# Altium project CAN_to_USB_TIVA.PrjPCB
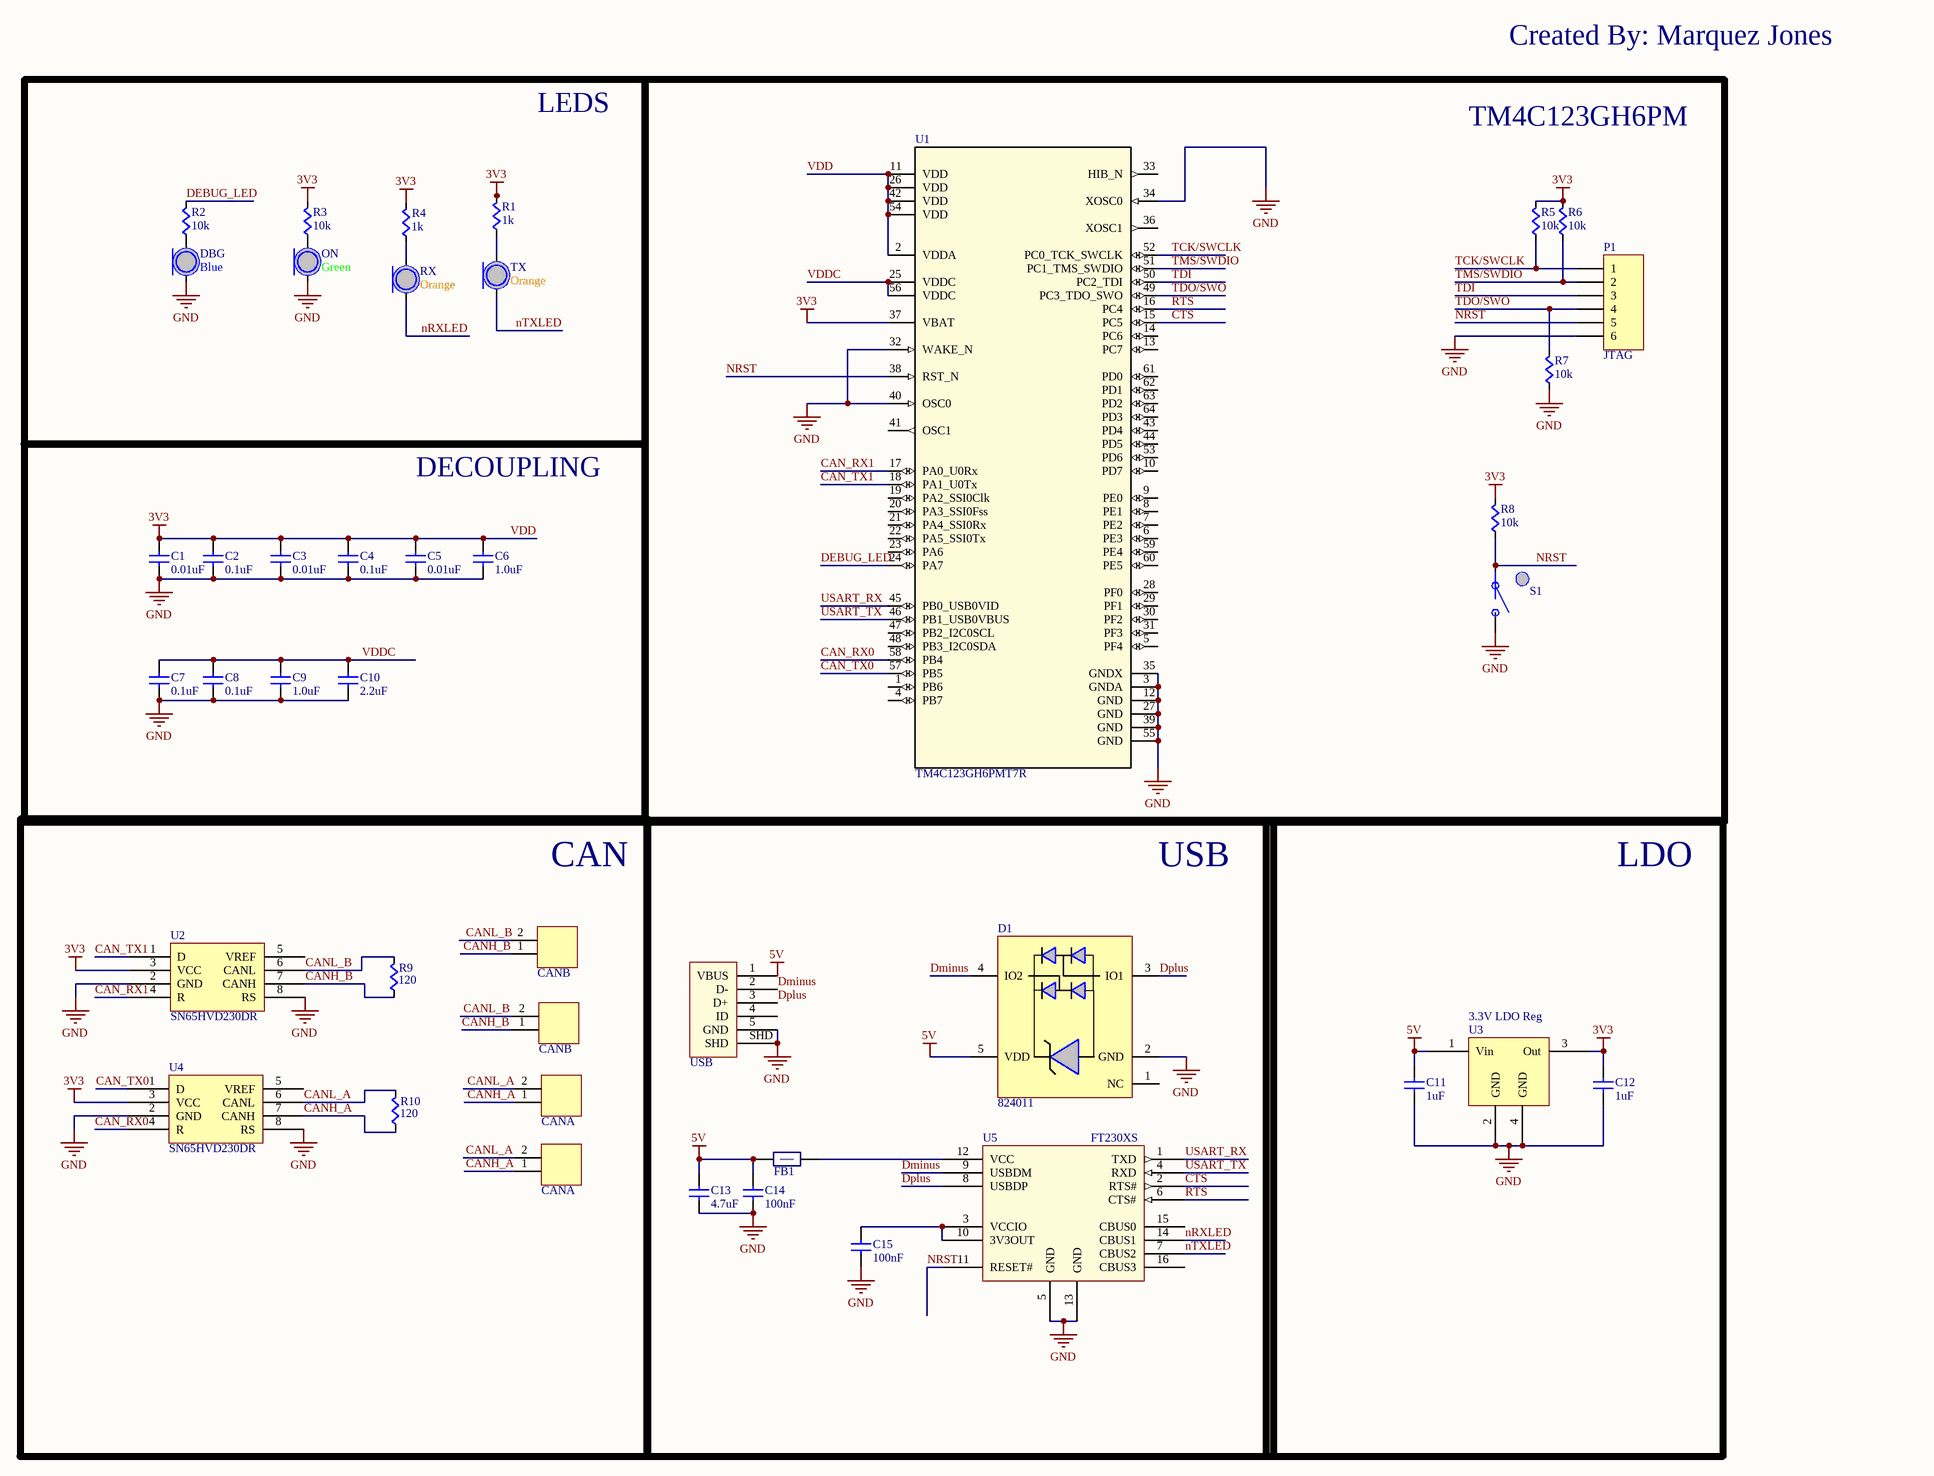
[diagram p0: CAN_TO_USB_TIVA.SchDoc]
1 sheet, 43 parts. Net scope: global (net labels, ports and power ports of the same name join across sheets).
Board file: USB_to_CAN.PcbDoc

## Sheet CAN_TO_USB_TIVA.SchDoc
size C

### Parts
(Parts that share a designator on the sheet are numbered #1, #2 ... from top to bottom, then left to right.)
C1  value 0.01uF  [CAPC0603]  (hidden comment: Cap)
C2  value 0.1uF  [CAPC0603]  (hidden comment: Cap)
C3  value 0.01uF  [CAPC0603]  (hidden comment: Cap)
C4  value 0.1uF  [CAPC0603]  (hidden comment: Cap)
C5  value 0.01uF  [CAPC0603]  (hidden comment: Cap)
C6  value 1.0uF  [CAPC0603]  (hidden comment: Cap)
C7  value 0.1uF  [CAPC0603]  (hidden comment: Cap)
C8  value 0.1uF  [CAPC0603]  (hidden comment: Cap)
C9  value 1.0uF  [CAPC0603]  (hidden comment: Cap)
C10  value 2.2uF  [CAPC0603]  (hidden comment: Cap)
C11  value 1uF  [CAPC0603]  (hidden comment: Cap)
C12  value 1uF  [CAPC0603]  (hidden comment: Cap)
C13  value 4.7uF  [CAPC0603]  (hidden comment: Cap)
C14  value 100nF  [CAPC0603]  (hidden comment: Cap)
C15  value 100nF  [CAPC0603]  (hidden comment: Cap)
CANA#1  2-pin Horz Sherlock  [MOLEX-HDR-1X2-SHERLOCK-HORZ]  (value not drawn)
CANA#2  2-pin Horz Sherlock  [MOLEX-HDR-1X2-SHERLOCK-HORZ]  (value not drawn)
CANB#1  2-pin Horz Sherlock  [MOLEX-HDR-1X2-SHERLOCK-HORZ]  (value not drawn)
CANB#2  2-pin Horz Sherlock  [MOLEX-HDR-1X2-SHERLOCK-HORZ]  (value not drawn)
D1  824011  [SOT95P280X116-5N]
DBG  Color: Blue  [LED0603]  (hidden comment: LED)
FB1  FBead  [RES0603]  (value not drawn)
ON  Color: Green  [LED0603]  (hidden comment: LED)
P1  JTAG  [HDR1X6]
R1  value 1k  [RES0603]  (hidden comment: Res)
R2  value 10k  [RES0603]  (hidden comment: Res)
R3  value 10k  [RES0603]  (hidden comment: Res)
R4  value 1k  [RES0603]  (hidden comment: Res)
R5  value 10k  [RES0603]  (hidden comment: Res)
R6  value 10k  [RES0603]  (hidden comment: Res)
R7  value 10k  [RES0603]  (hidden comment: Res)
R8  value 10k  [RES0603]  (hidden comment: Res)
R9  value 120  [RES0603]  (hidden comment: Res)
R10  value 120  [RES0603]  (hidden comment: Res)
RX  Color: Orange  [LED0603]  (hidden comment: LED)
S1  Button  [PTS645xxxxSMTR92]  (value not drawn)
TX  Color: Orange  [LED0603]  (hidden comment: LED)
U1  TM4C123GH6PMT7R  [PM0064A_N]
U2  SN65HVD230DR  [SOIC-8pin]
U3  3.3V LDO Reg  [SOT23-4n]
U4  SN65HVD230DR  [SOIC-8pin]
U5  FT230XS  [FT230XS]
USB  UX60SC-MB-5ST  [UX60SC-MB-5ST]  (value not drawn)

### Blocks framed on the sheet
LEDS: DBG ON R1-R4 RX TX
TM4C123GH6PM: P1 R5-R8 S1 U1
DECOUPLING: C1-C10
CAN: CANA#1 CANA#2 CANB#1 CANB#2 R9 R10 U2 U4
USB: C13-C15 D1 FB1 U5 USB
LDO: C11 C12 U3

### Nets
5V: C11.1(A) C13.1(A) C14.1(A) D1.5(VDD) FB1.1(A) U3.1(Vin) USB.1(VBUS)
GND: C1.2(B) C2.2(B) C3.2(B) C4.2(B) C5.2(B) C6.2(B) C7.2(B) C8.2(B) C9.2(B) C10.2(B) C11.2(B) C12.2(B) C13.2(B) C14.2(B) C15.2(B) D1.2(GND) DBG.C ON.C P1.6 R7.2(B) S1.B U1.3(GNDA) U1.12(GND) U1.27(GND) U1.32(WAKE_N) U1.34(XOSC0) U1.35(GNDX) U1.39(GND) U1.40(OSC0) U1.55(GND) U2.2(GND) U2.8(RS) U3.2(GND) U3.4(GND) U4.2(GND) U4.8(RS) U5.5(GND) U5.13(GND) USB.5(GND) USB.SHD
VDD: C1.1(A) C2.1(A) C3.1(A) C4.1(A) C5.1(A) C6.1(A) C12.1(A) R1.1(A) R3.1(A) R4.1(A) R5.1(A) R6.1(A) R8.1(A) U1.2(VDDA) U1.11(VDD) U1.26(VDD) U1.37(VBAT) U1.42(VDD) U1.54(VDD) U2.3(VCC) U3.3(Out) U4.3(VCC)  [also labelled 3V3]
CAN_RX0: U1.58(PB4) U4.4(R)
CAN_RX1: U1.17(PA0_U0Rx) U2.4(R)
CAN_TX0: U1.57(PB5) U4.1(D)
CAN_TX1: U1.18(PA1_U0Tx) U2.1(D)
CANH_A: CANA#1.1 CANA#2.1 R10.2(B) U4.7(CANH)
CANH_B: CANB#1.1 CANB#2.1 R9.2(B) U2.7(CANH)
CANL_A: CANA#1.2 CANA#2.2 R10.1(A) U4.6(CANL)
CANL_B: CANB#1.2 CANB#2.2 R9.1(A) U2.6(CANL)
CTS: U1.15(PC5) U5.2(RTS#)
DEBUG_LED: R2.1(A) U1.24(PA7)
Dminus: D1.4(IO2) U5.9(USBDM) USB.2(D-)
Dplus: D1.3(IO1) U5.8(USBDP) USB.3(D+)
NRST: P1.5 R8.2(B) S1.A U1.38(RST_N) U5.11(RESET#)
nRXLED: RX.C U5.14(CBUS1)
nTXLED: TX.C U5.7(CBUS2)
RTS: U1.16(PC4) U5.6(CTS#)
TCK/SWCLK: P1.1 R5.2(B) U1.52(PC0_TCK_SWCLK)
TDI: P1.3 U1.50(PC2_TDI)
TDO/SWO: P1.4 R7.1(A) U1.49(PC3_TDO_SWO)
TMS/SWDIO: P1.2 R6.2(B) U1.51(PC1_TMS_SWDIO)
USART_RX: U1.45(PB0_USB0VID) U5.1(TXD)
USART_TX: U1.46(PB1_USB0VBUS) U5.4(RXD)
VDDC: C7.1(A) C8.1(A) C9.1(A) C10.1(A) U1.25(VDDC) U1.56(VDDC)
NetC15_1: C15.1(A) U5.3(VCCIO) U5.10(3V3OUT)
NetDBG_A: DBG.A R2.2(B)
NetFB1_2: FB1.2(B) U5.12(VCC)
NetON_A: ON.A R3.2(B)
NetR1_2: R1.2(B) TX.A
NetR4_2: R4.2(B) RX.A

Not connected (* = marked no-connect by the designer): D1 1(NC); U1 1(PB6) 4(PB7) 5(PF4) 6(PE3) 7(PE2) 8(PE1) 9(PE0) 10(PD7) 13(PC7) 14(PC6) 19(PA2_SSI0Clk) 20(PA3_SSI0Fss) 21(PA4_SSI0Rx) 22(PA5_SSI0Tx) 23(PA6) 28(PF0) 29(PF1) 30(PF2) 31(PF3) 33(HIB_N) 36(XOSC1) 41(OSC1) 43(PD4) 44(PD5) 47(PB2_I2C0SCL) 48(PB3_I2C0SDA) 53(PD6) 59(PE4) 60(PE5) 61(PD0) 62(PD1) 63(PD2) 64(PD3); U2 5(VREF); U4 5(VREF); U5 15(CBUS0) 16(CBUS3); USB 4(ID)

### Notes on the sheet
- Created By: Marquez Jones

### Library data of the parts
C11 C12 = Cap: Manufacturer Part Number: C0603C105K8PACTU; Supplier 1: Digi-Key; Supplier Part Number 1: 399-3118-1-ND
CANA#1 CANA#2 CANB#1 CANB#2 = MOLEX-HDR-1x2-SHERLOCK_RA: Header, Molex, 2mm Pitch Sherlock Header, Single Row, Horizontal, 2 Circuits, Length 3.3mm,  0353630260; Manufacturer: Molex Inc; Manufacturer Part Number: 0353630260; Supplier Part Number 1: WM18931-ND; Supplier 1: Digi-Key
D1 = 824011: USB ESD Protection Diodes
FB1 = FBead: Ferrite Bead; Supplier 1: Digi-Key; Supplier Part Number 1: 445-2988-1-ND
P1 = Header 6: Header, 6-Pin; LatestRevisionDate: 17-Jul-2002; LatestRevisionNote: Re-released for DXP Platform.; Publisher: Altium Limited
S1 = Button: SPST Button; Supplier 1: Digi-Key; Supplier Part Number 1: CKN9087CT-ND
U1 = TM4C123GH6PMT7R: Imported; PartNumber: TM4C123GH6PMTR; Manufacturer: Texas Instruments; CompType: IC; PIN_COUNT: 64; Application_BuildNumber: *; Alternate_PartNumber: TM4C123GH6PMT; PackageReference: PM0064A; MountType: SMT; RoHS: Y; RefDes: RefDes; TYPE: TYPE; Value: Value
U2 U4 = SN65HVD230DR: IC TXRX CAN 1MBPS 3.3V 8SOIC; Supplier 1: Digi-Key; Supplier Part Numbe 1: 296-11654-1-ND
U3 = LM3940IMPX-3.3: IC REG LDO 3.3V 1A SOT223; Supplier 1: Digi-Key; Supplier Part Number 1: LM3940IMPX-3.3/NOPBCT-ND
U5 = FT230XS: USB To Basic UART IC; Supplier 1: Digi-Key; Supplier Part Number 1: 768-1154-5-ND
USB = UX60SC-MB-5ST: USB Mini B Metal Shield SMT; Supplier 1: Digi-Key; Supplier Part Number 1: H11671CT-ND
C1-C10 C13-C15 = Cap: Supplier 1: Digi-Key
  C1-C10 C14 C15: Supplier Part Number 1: 1276-1000-1-ND
  C13: Supplier Part Number 1: 311-1455-1-ND
DBG ON RX TX = LED: Supplier 1: Digi-Key; Supplier Part Number 1: 754-1122-1-ND
R1-R10 = Res: Supplier 1: Digi-Key; Supplier Part Number 1: RMCF0603JT10K0CT-ND